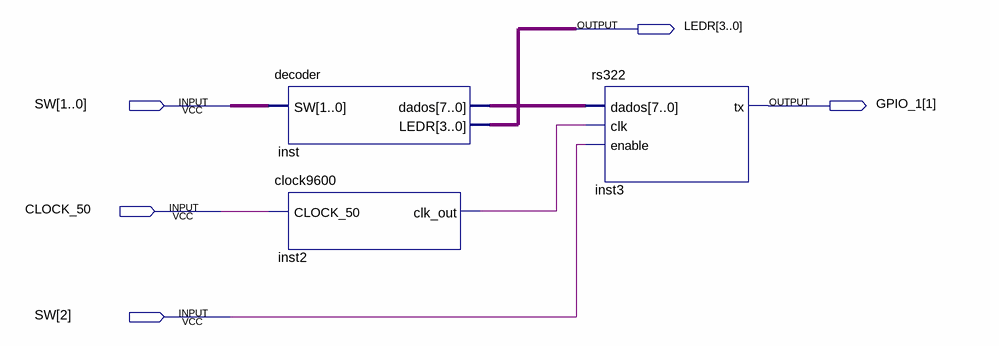
[diagram p0: schematic sheet]
// Quartus schematic Serial.bdf as structural Verilog: 3 symbols, 5 pins
module Serial (
  input  [2:0] SW,
  input  CLOCK_50,
  output [3:0] LEDR,
  output [1:1] GPIO_1
);

  wire inst2_clk_out;
  wire [7:0] inst_dados;

  decoder inst (.SW(SW[1:0]), .dados(inst_dados), .LEDR(LEDR));
  clock9600 inst2 (.CLOCK_50(CLOCK_50), .clk_out(inst2_clk_out));
  rs322 inst3 (.dados(inst_dados), .clk(inst2_clk_out), .enable(SW[2]), .tx(GPIO_1[1]));
endmodule
